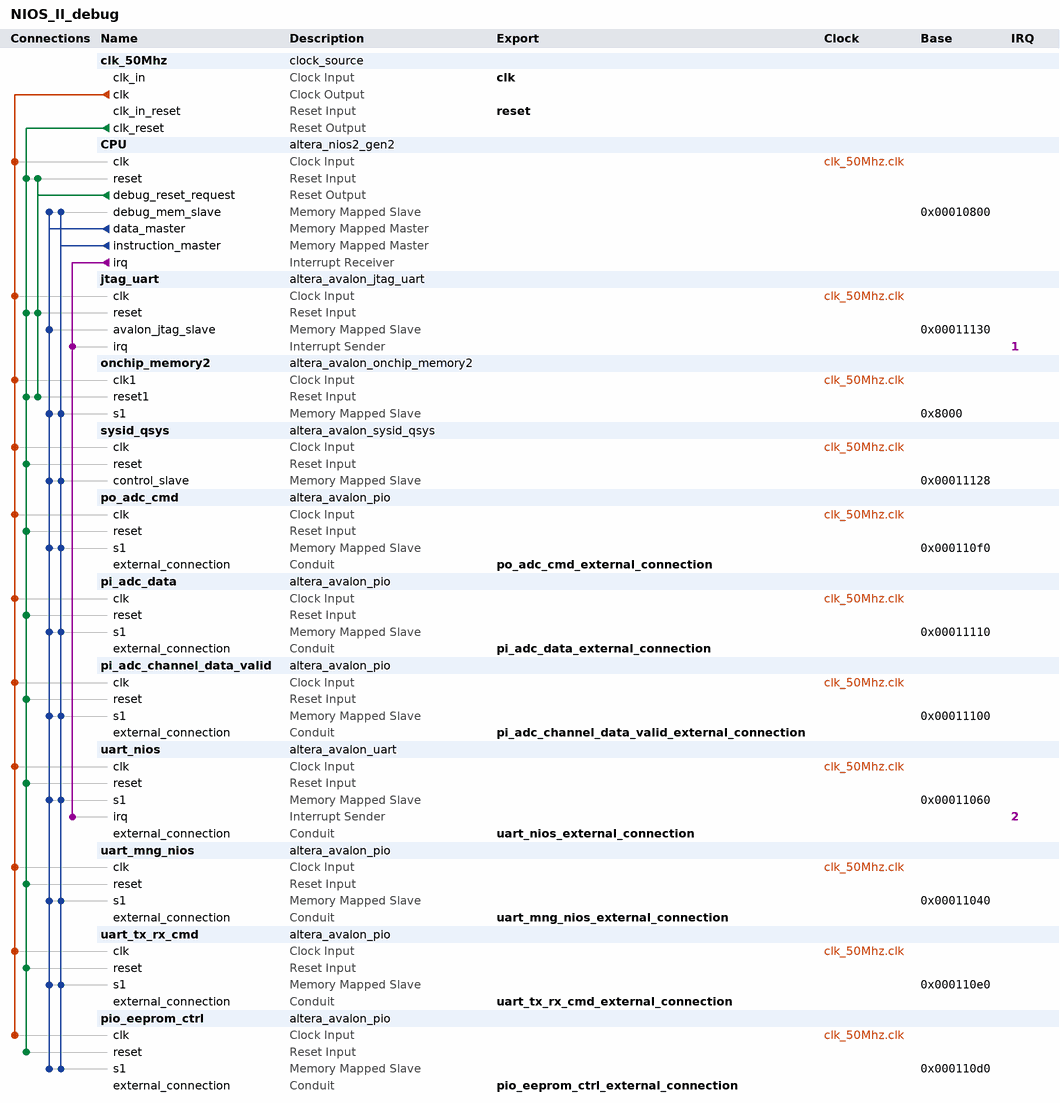
[diagram p0: system contents]
# Platform Designer (Qsys) system NIOS_II_debug, Cyclone IV E EP4CE22F17C6
# Parameters at their usual value, and those the tool derives, are not listed.
package require -exact qsys 18.1
create_system NIOS_II_debug
set_project_property DEVICE_FAMILY {Cyclone IV E}
set_project_property DEVICE EP4CE22F17C6

add_instance clk_50Mhz clock_source 18.1
set_instance_parameter_value clk_50Mhz clockFrequency 50000000

add_instance CPU altera_nios2_gen2 18.1
set_instance_parameter_value CPU dcache_size 2048
set_instance_parameter_value CPU exceptionSlave onchip_memory2.s1
set_instance_parameter_value CPU icache_size 4096
set_instance_parameter_value CPU impl Tiny
set_instance_parameter_value CPU resetSlave onchip_memory2.s1

add_instance jtag_uart altera_avalon_jtag_uart 18.1
set_instance_parameter_value jtag_uart simInteractiveOptions NO_INTERACTIVE_WINDOWS

add_instance onchip_memory2 altera_avalon_onchip_memory2 18.1
set_instance_parameter_value onchip_memory2 dataWidth 32
set_instance_parameter_value onchip_memory2 dualPort false
set_instance_parameter_value onchip_memory2 initMemContent true
set_instance_parameter_value onchip_memory2 initializationFileName onchip_mem.hex
set_instance_parameter_value onchip_memory2 memorySize 32768

add_instance sysid_qsys altera_avalon_sysid_qsys 18.1
set_instance_parameter_value sysid_qsys id 0

add_instance po_adc_cmd altera_avalon_pio 18.1
set_instance_parameter_value po_adc_cmd direction Output
set_instance_parameter_value po_adc_cmd width 4

add_instance pi_adc_data altera_avalon_pio 18.1
set_instance_parameter_value pi_adc_data direction Input
set_instance_parameter_value pi_adc_data width 12

add_instance pi_adc_channel_data_valid altera_avalon_pio 18.1
set_instance_parameter_value pi_adc_channel_data_valid direction Input
set_instance_parameter_value pi_adc_channel_data_valid width 4

add_instance uart_nios altera_avalon_uart 18.1
set_instance_parameter_value uart_nios baud 9600
set_instance_parameter_value uart_nios dataBits 8
set_instance_parameter_value uart_nios fixedBaud false
set_instance_parameter_value uart_nios parity NONE
set_instance_parameter_value uart_nios stopBits 1

add_instance uart_mng_nios altera_avalon_pio 18.1
set_instance_parameter_value uart_mng_nios bitModifyingOutReg true
set_instance_parameter_value uart_mng_nios direction InOut
set_instance_parameter_value uart_mng_nios width 8

add_instance uart_tx_rx_cmd altera_avalon_pio 18.1
set_instance_parameter_value uart_tx_rx_cmd direction InOut
set_instance_parameter_value uart_tx_rx_cmd width 3

add_instance pio_eeprom_ctrl altera_avalon_pio 18.1
set_instance_parameter_value pio_eeprom_ctrl direction InOut
set_instance_parameter_value pio_eeprom_ctrl width 11

# connections
add_connection clk_50Mhz.clk CPU.clk clock
add_connection clk_50Mhz.clk jtag_uart.clk clock
add_connection clk_50Mhz.clk onchip_memory2.clk1 clock
add_connection clk_50Mhz.clk pi_adc_channel_data_valid.clk clock
add_connection clk_50Mhz.clk pi_adc_data.clk clock
add_connection clk_50Mhz.clk pio_eeprom_ctrl.clk clock
add_connection clk_50Mhz.clk po_adc_cmd.clk clock
add_connection clk_50Mhz.clk sysid_qsys.clk clock
add_connection clk_50Mhz.clk uart_mng_nios.clk clock
add_connection clk_50Mhz.clk uart_nios.clk clock
add_connection clk_50Mhz.clk uart_tx_rx_cmd.clk clock
add_connection clk_50Mhz.clk_reset CPU.reset reset
add_connection clk_50Mhz.clk_reset jtag_uart.reset reset
add_connection clk_50Mhz.clk_reset onchip_memory2.reset1 reset
add_connection clk_50Mhz.clk_reset pi_adc_channel_data_valid.reset reset
add_connection clk_50Mhz.clk_reset pi_adc_data.reset reset
add_connection clk_50Mhz.clk_reset pio_eeprom_ctrl.reset reset
add_connection clk_50Mhz.clk_reset po_adc_cmd.reset reset
add_connection clk_50Mhz.clk_reset sysid_qsys.reset reset
add_connection clk_50Mhz.clk_reset uart_mng_nios.reset reset
add_connection clk_50Mhz.clk_reset uart_nios.reset reset
add_connection clk_50Mhz.clk_reset uart_tx_rx_cmd.reset reset
add_connection CPU.debug_reset_request CPU.reset reset
add_connection CPU.debug_reset_request jtag_uart.reset reset
add_connection CPU.debug_reset_request onchip_memory2.reset1 reset
add_connection CPU.data_master CPU.debug_mem_slave avalon
set_connection_parameter_value CPU.data_master/CPU.debug_mem_slave baseAddress 0x00010800
add_connection CPU.data_master jtag_uart.avalon_jtag_slave avalon
set_connection_parameter_value CPU.data_master/jtag_uart.avalon_jtag_slave baseAddress 0x00011130
add_connection CPU.data_master onchip_memory2.s1 avalon
set_connection_parameter_value CPU.data_master/onchip_memory2.s1 baseAddress 0x8000
add_connection CPU.data_master pi_adc_channel_data_valid.s1 avalon
set_connection_parameter_value CPU.data_master/pi_adc_channel_data_valid.s1 baseAddress 0x00011100
add_connection CPU.data_master pi_adc_data.s1 avalon
set_connection_parameter_value CPU.data_master/pi_adc_data.s1 baseAddress 0x00011110
add_connection CPU.data_master pio_eeprom_ctrl.s1 avalon
set_connection_parameter_value CPU.data_master/pio_eeprom_ctrl.s1 baseAddress 0x000110d0
add_connection CPU.data_master po_adc_cmd.s1 avalon
set_connection_parameter_value CPU.data_master/po_adc_cmd.s1 baseAddress 0x000110f0
add_connection CPU.data_master sysid_qsys.control_slave avalon
set_connection_parameter_value CPU.data_master/sysid_qsys.control_slave baseAddress 0x00011128
add_connection CPU.data_master uart_mng_nios.s1 avalon
set_connection_parameter_value CPU.data_master/uart_mng_nios.s1 baseAddress 0x00011040
add_connection CPU.data_master uart_nios.s1 avalon
set_connection_parameter_value CPU.data_master/uart_nios.s1 baseAddress 0x00011060
add_connection CPU.data_master uart_tx_rx_cmd.s1 avalon
set_connection_parameter_value CPU.data_master/uart_tx_rx_cmd.s1 baseAddress 0x000110e0
add_connection CPU.instruction_master CPU.debug_mem_slave avalon
set_connection_parameter_value CPU.instruction_master/CPU.debug_mem_slave baseAddress 0x00010800
add_connection CPU.instruction_master onchip_memory2.s1 avalon
set_connection_parameter_value CPU.instruction_master/onchip_memory2.s1 baseAddress 0x8000
add_connection CPU.instruction_master pi_adc_channel_data_valid.s1 avalon
set_connection_parameter_value CPU.instruction_master/pi_adc_channel_data_valid.s1 baseAddress 0x00011100
add_connection CPU.instruction_master pi_adc_data.s1 avalon
set_connection_parameter_value CPU.instruction_master/pi_adc_data.s1 baseAddress 0x00011110
add_connection CPU.instruction_master pio_eeprom_ctrl.s1 avalon
set_connection_parameter_value CPU.instruction_master/pio_eeprom_ctrl.s1 baseAddress 0x000110d0
add_connection CPU.instruction_master po_adc_cmd.s1 avalon
set_connection_parameter_value CPU.instruction_master/po_adc_cmd.s1 baseAddress 0x000110f0
add_connection CPU.instruction_master sysid_qsys.control_slave avalon
set_connection_parameter_value CPU.instruction_master/sysid_qsys.control_slave baseAddress 0x00011128
add_connection CPU.instruction_master uart_mng_nios.s1 avalon
set_connection_parameter_value CPU.instruction_master/uart_mng_nios.s1 baseAddress 0x00011040
add_connection CPU.instruction_master uart_nios.s1 avalon
set_connection_parameter_value CPU.instruction_master/uart_nios.s1 baseAddress 0x00011060
add_connection CPU.instruction_master uart_tx_rx_cmd.s1 avalon
set_connection_parameter_value CPU.instruction_master/uart_tx_rx_cmd.s1 baseAddress 0x000110e0
add_connection CPU.irq jtag_uart.irq interrupt
set_connection_parameter_value CPU.irq/jtag_uart.irq irqNumber 1
add_connection CPU.irq uart_nios.irq interrupt
set_connection_parameter_value CPU.irq/uart_nios.irq irqNumber 2

# exported interfaces
add_interface clk clock sink
set_interface_property clk EXPORT_OF clk_50Mhz.clk_in
add_interface pi_adc_channel_data_valid_external_connection conduit end
set_interface_property pi_adc_channel_data_valid_external_connection EXPORT_OF pi_adc_channel_data_valid.external_connection
add_interface pi_adc_data_external_connection conduit end
set_interface_property pi_adc_data_external_connection EXPORT_OF pi_adc_data.external_connection
add_interface pio_eeprom_ctrl_external_connection conduit end
set_interface_property pio_eeprom_ctrl_external_connection EXPORT_OF pio_eeprom_ctrl.external_connection
add_interface po_adc_cmd_external_connection conduit end
set_interface_property po_adc_cmd_external_connection EXPORT_OF po_adc_cmd.external_connection
add_interface reset reset sink
set_interface_property reset EXPORT_OF clk_50Mhz.clk_in_reset
add_interface uart_mng_nios_external_connection conduit end
set_interface_property uart_mng_nios_external_connection EXPORT_OF uart_mng_nios.external_connection
add_interface uart_nios_external_connection conduit end
set_interface_property uart_nios_external_connection EXPORT_OF uart_nios.external_connection
add_interface uart_tx_rx_cmd_external_connection conduit end
set_interface_property uart_tx_rx_cmd_external_connection EXPORT_OF uart_tx_rx_cmd.external_connection

set_interconnect_requirement {$system} qsys_mm.clockCrossingAdapter HANDSHAKE
set_interconnect_requirement {$system} qsys_mm.enableEccProtection FALSE
set_interconnect_requirement {$system} qsys_mm.insertDefaultSlave FALSE
set_interconnect_requirement {$system} qsys_mm.maxAdditionalLatency 1

save_system NIOS_II_debug.qsys
